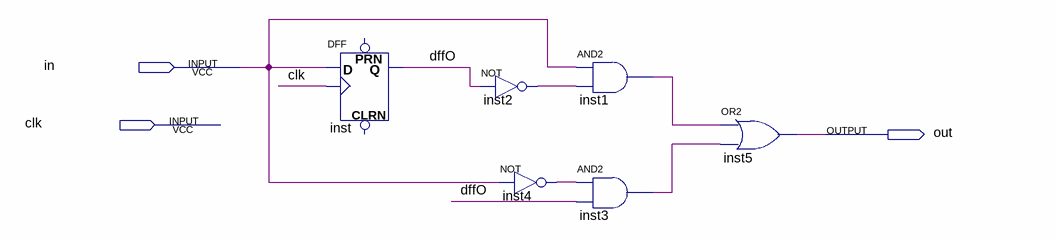
[diagram p0: schematic sheet]
// Quartus schematic EdgeDetector.bdf as structural Verilog: 6 symbols, 3 pins
module EdgeDetector (
  input  in,
  input  clk,
  output out
);

  wire dffO, inst1_out, inst2_out, inst3_out, inst4_out;

  DFF inst (.CLK(clk), .D(in), .Q(dffO));  // open: CLRN, PRN
  not inst2 (inst2_out, dffO);
  not inst4 (inst4_out, in);
  and inst1 (inst1_out, in, inst2_out);
  and inst3 (inst3_out, inst4_out, dffO);
  or inst5 (out, inst1_out, inst3_out);
endmodule
